# Altium schematic sheet P01.SchDoc
size 420 x 297 mm
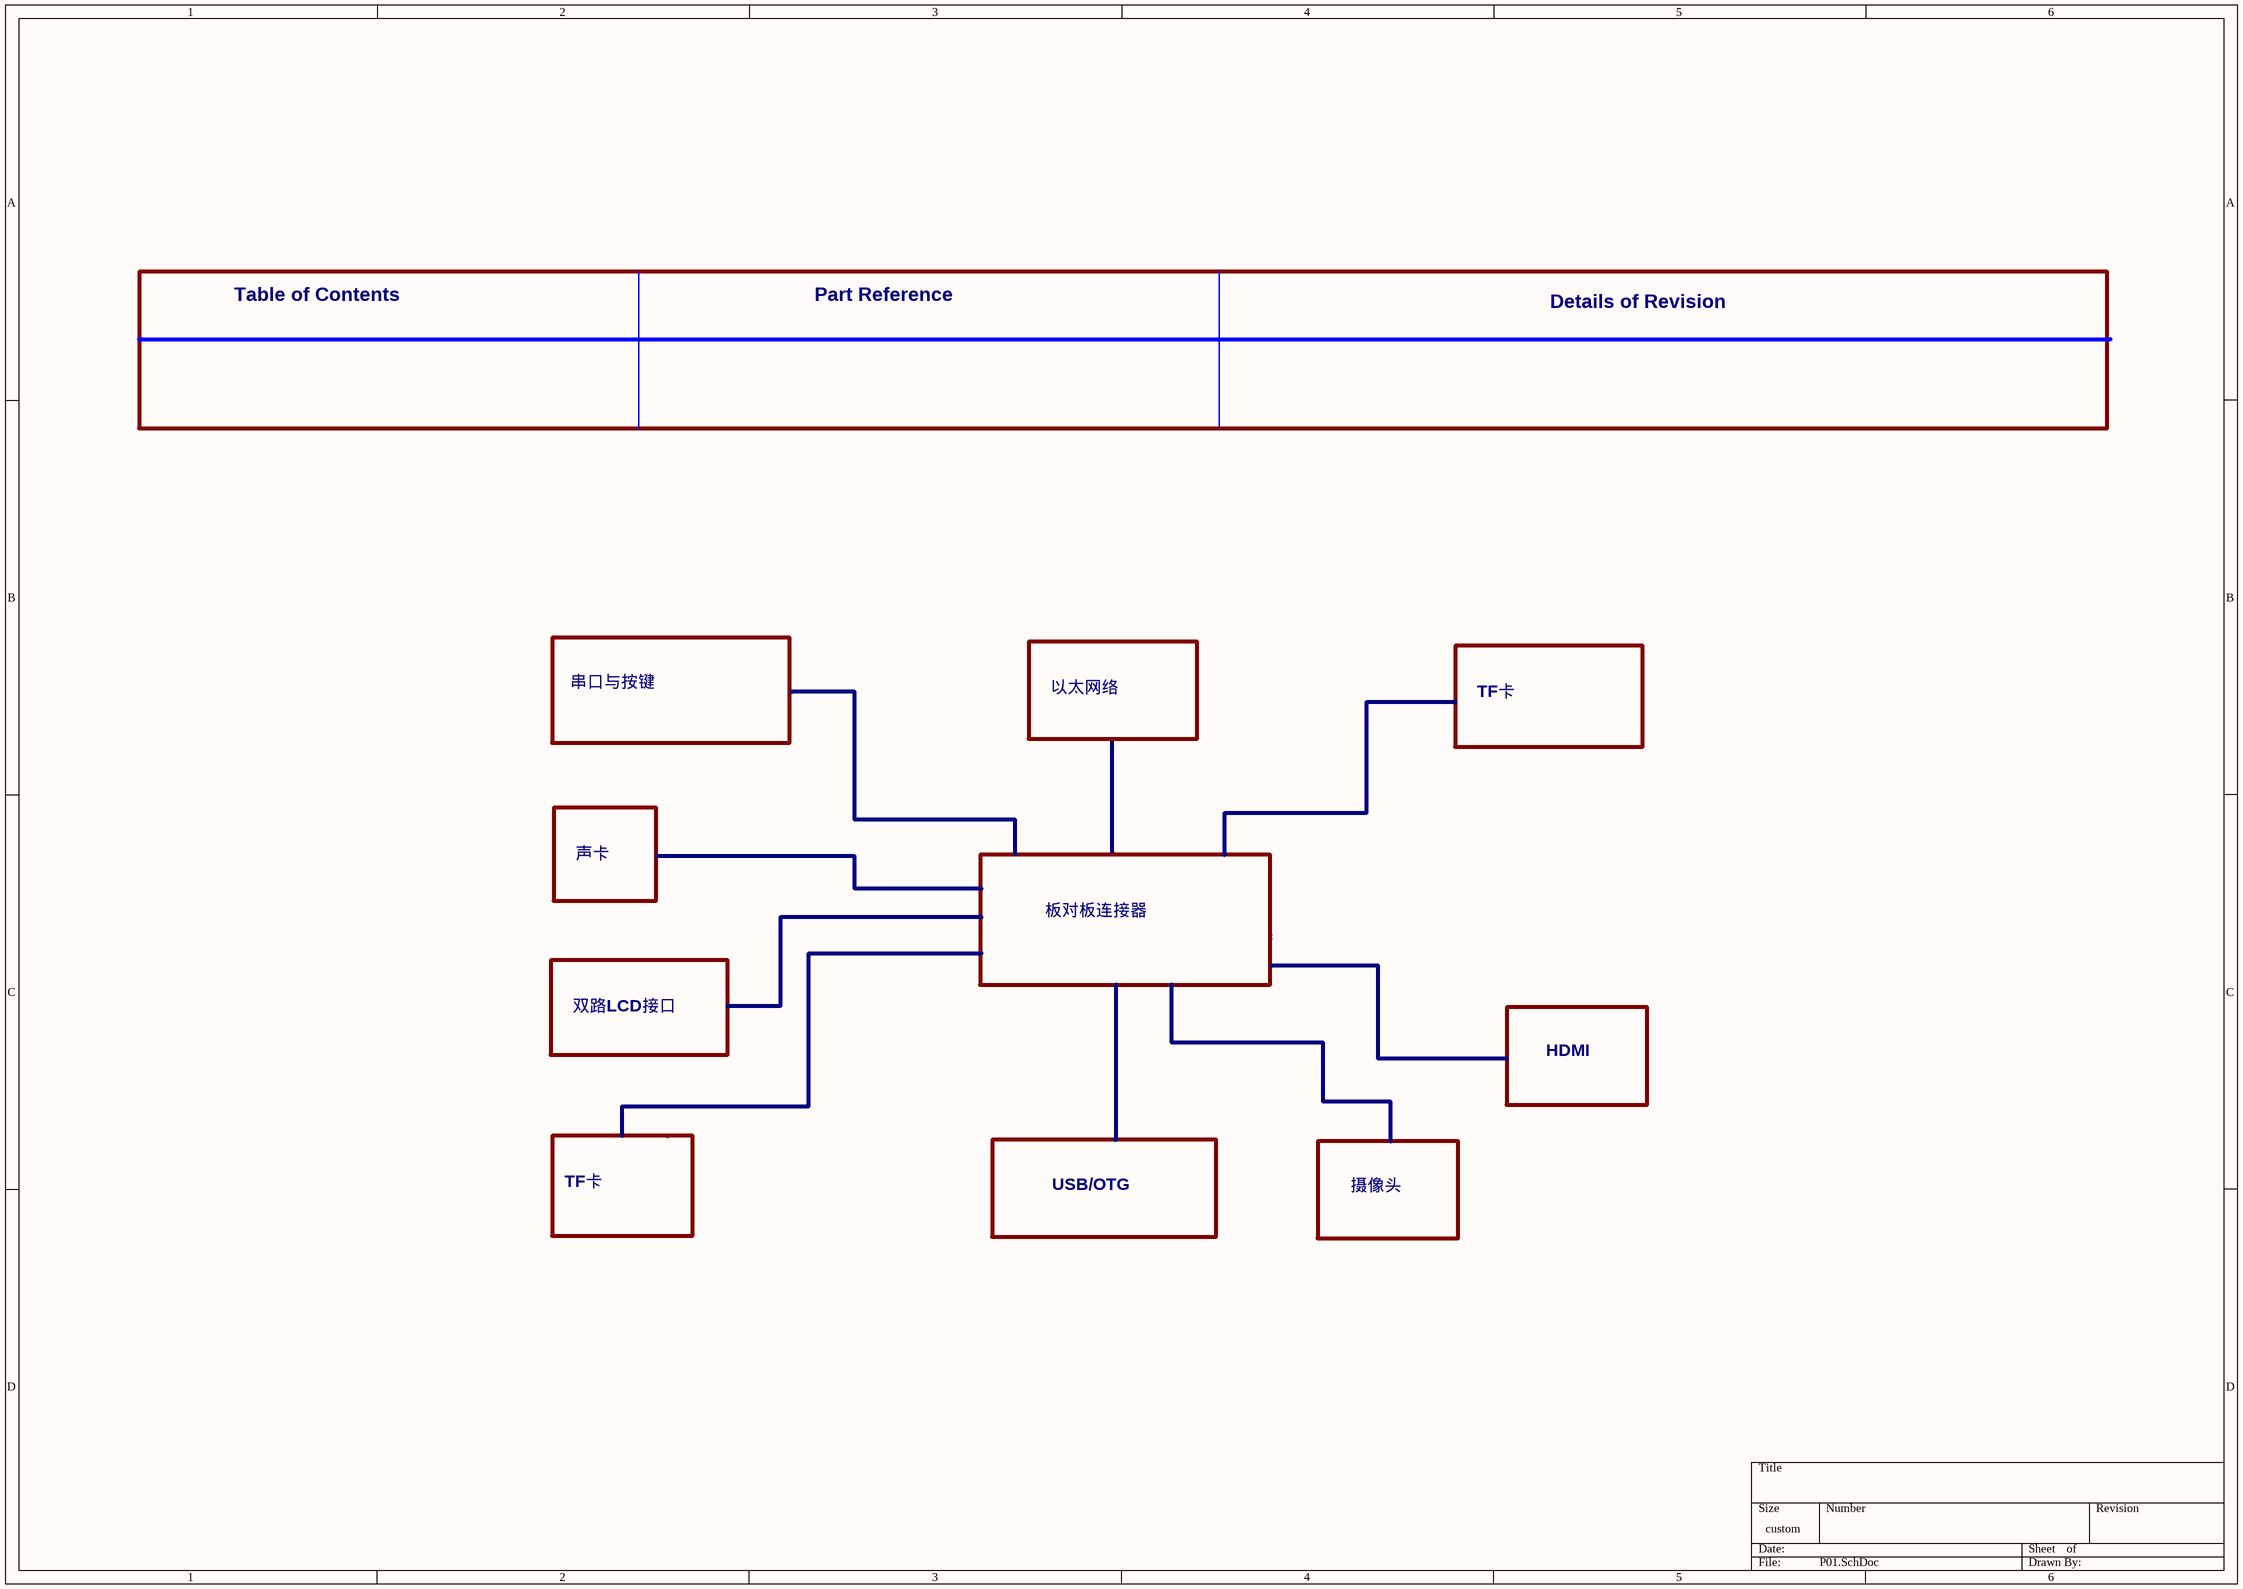
[diagram p0: P01.SchDoc]

## Notes on the sheet
- Table of Contents
- Part Reference
- Details of Revision
- 串口与按键
- 以太网络
- TF卡
- 声卡
- 板对板连接器
- 双路LCD接口
- HDMI
- USB/OTG
- 摄像头